# Altium schematic sheet TRACTIAN_Power.SchDoc
size A
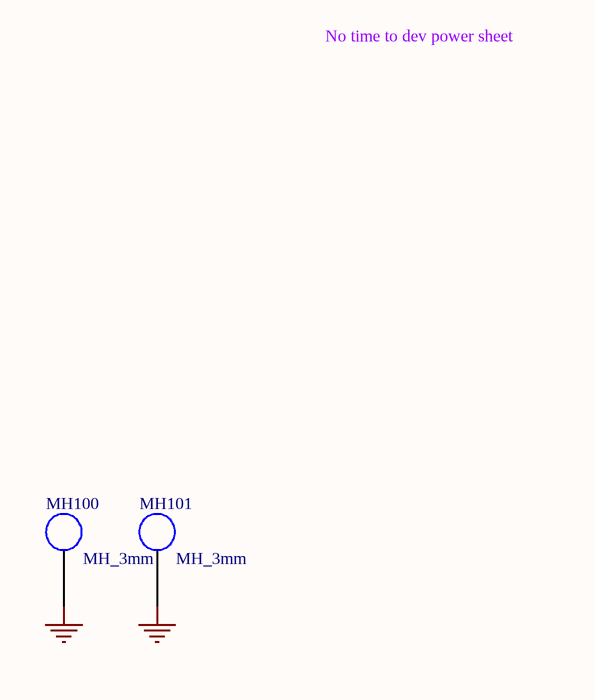
[diagram p0: TRACTIAN_Power.SchDoc]

## Parts
MH100  MH_3mm  [MH_3mm]
MH101  MH_3mm  [MH_3mm]

## Nets
GND: MH100.1(MH) MH101.1(MH)

## Notes on the sheet
- No time to dev power sheet